# EAGLE schematic fv-1 (EAGLE 8.7.0)
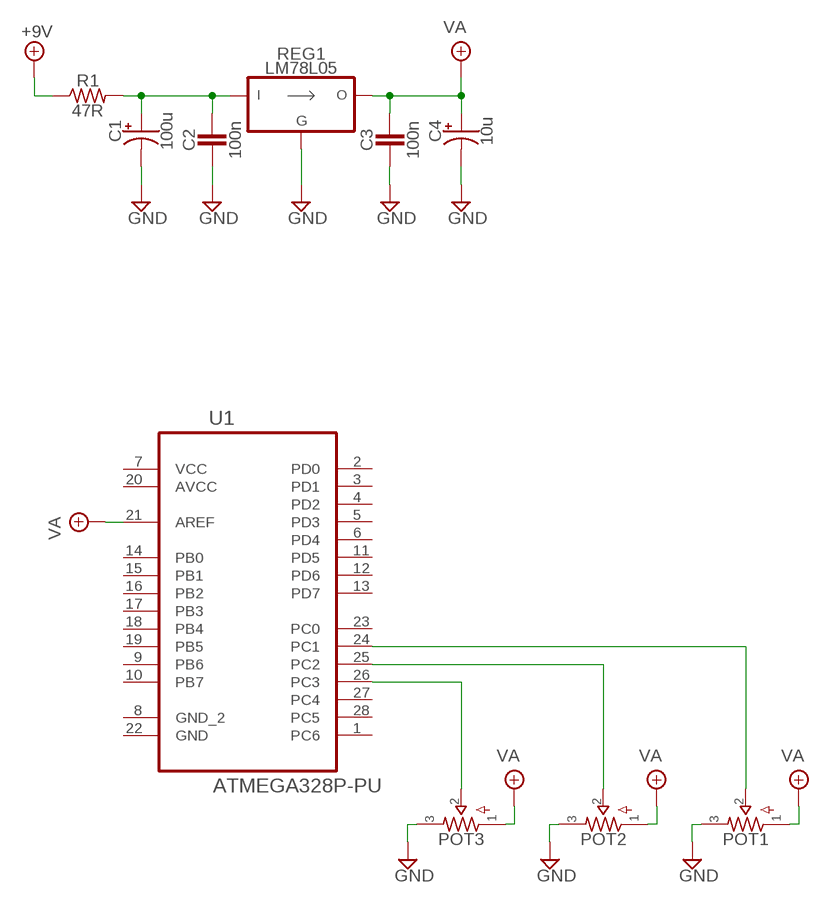
[diagram p0: schematic, sheet 1]

## Parts
C1  100u  0501  [050_020_1]
C2  100n  CER/FILM2  [050X030_025_2]
C3  100n  CER/FILM2  [050X030_025_2]
C4  10u  0501  [050_020_1]
POT1  POTS16MM  [16MM]
POT2  POTS16MM  [16MM]
POT3  POTS16MM  [16MM]
R1  47R  R_.3B  [R0207/3]
REG1  LM78L05  [TO92-]
U1  ATMEGA328P-PU  [DIP254P762X457-28]

## Nets
+9V: R1.1
GND: C1.- C2.2 C3.2 C4.- POT1.3 POT2.3 POT3.3 REG1.2(GND)
N$1: C1.+ C2.1 R1.2 REG1.1(VI)
N$3: POT3.2 U1.26(PC3)
N$4: POT2.2 U1.25(PC2)
N$5: POT1.2 U1.24(PC1)
VA: C3.1 C4.+ POT1.1 POT2.1 POT3.1 REG1.3(VO) U1.21(AREF)
Unconnected: U1.1(PC6) U1.2(PD0) U1.3(PD1) U1.4(PD2) U1.5(PD3) U1.6(PD4) U1.8(GND_2) U1.9(PB6) U1.10(PB7) U1.11(PD5) U1.12(PD6) U1.13(PD7) U1.14(PB0) U1.15(PB1) U1.16(PB2) U1.17(PB3) U1.18(PB4) U1.19(PB5) U1.22(GND) U1.23(PC0) U1.27(PC4) U1.28(PC5)

## Power pins joined to a net without a drawn wire
AVCC: U1.20(AVCC)
VCC: U1.7(VCC)

## Library data of the parts
C1 C4 = pedals-capacitors-elec:050
C2 C3 = pedals-capacitors-film:CER/FILM: 47 - 120pF Xicon Ceramic Disc 2.5mm lead spacing
POT1-POT3 = pedals-potentiometers:POTS
R1 = pedals-resistors:R_
REG1 = pedals-regulators:LM78L05
U1 = pedals-microcontrollers:ATMEGA328P-PU: 8-bit Microcontroller with In-System Programmable Flash; MPN: ATMEGA328P-PU; OC_FARNELL: 1715487; OC_NEWARK: 15R0268; PACKAGE: PDIP-28; SUPPLIER: Atmel